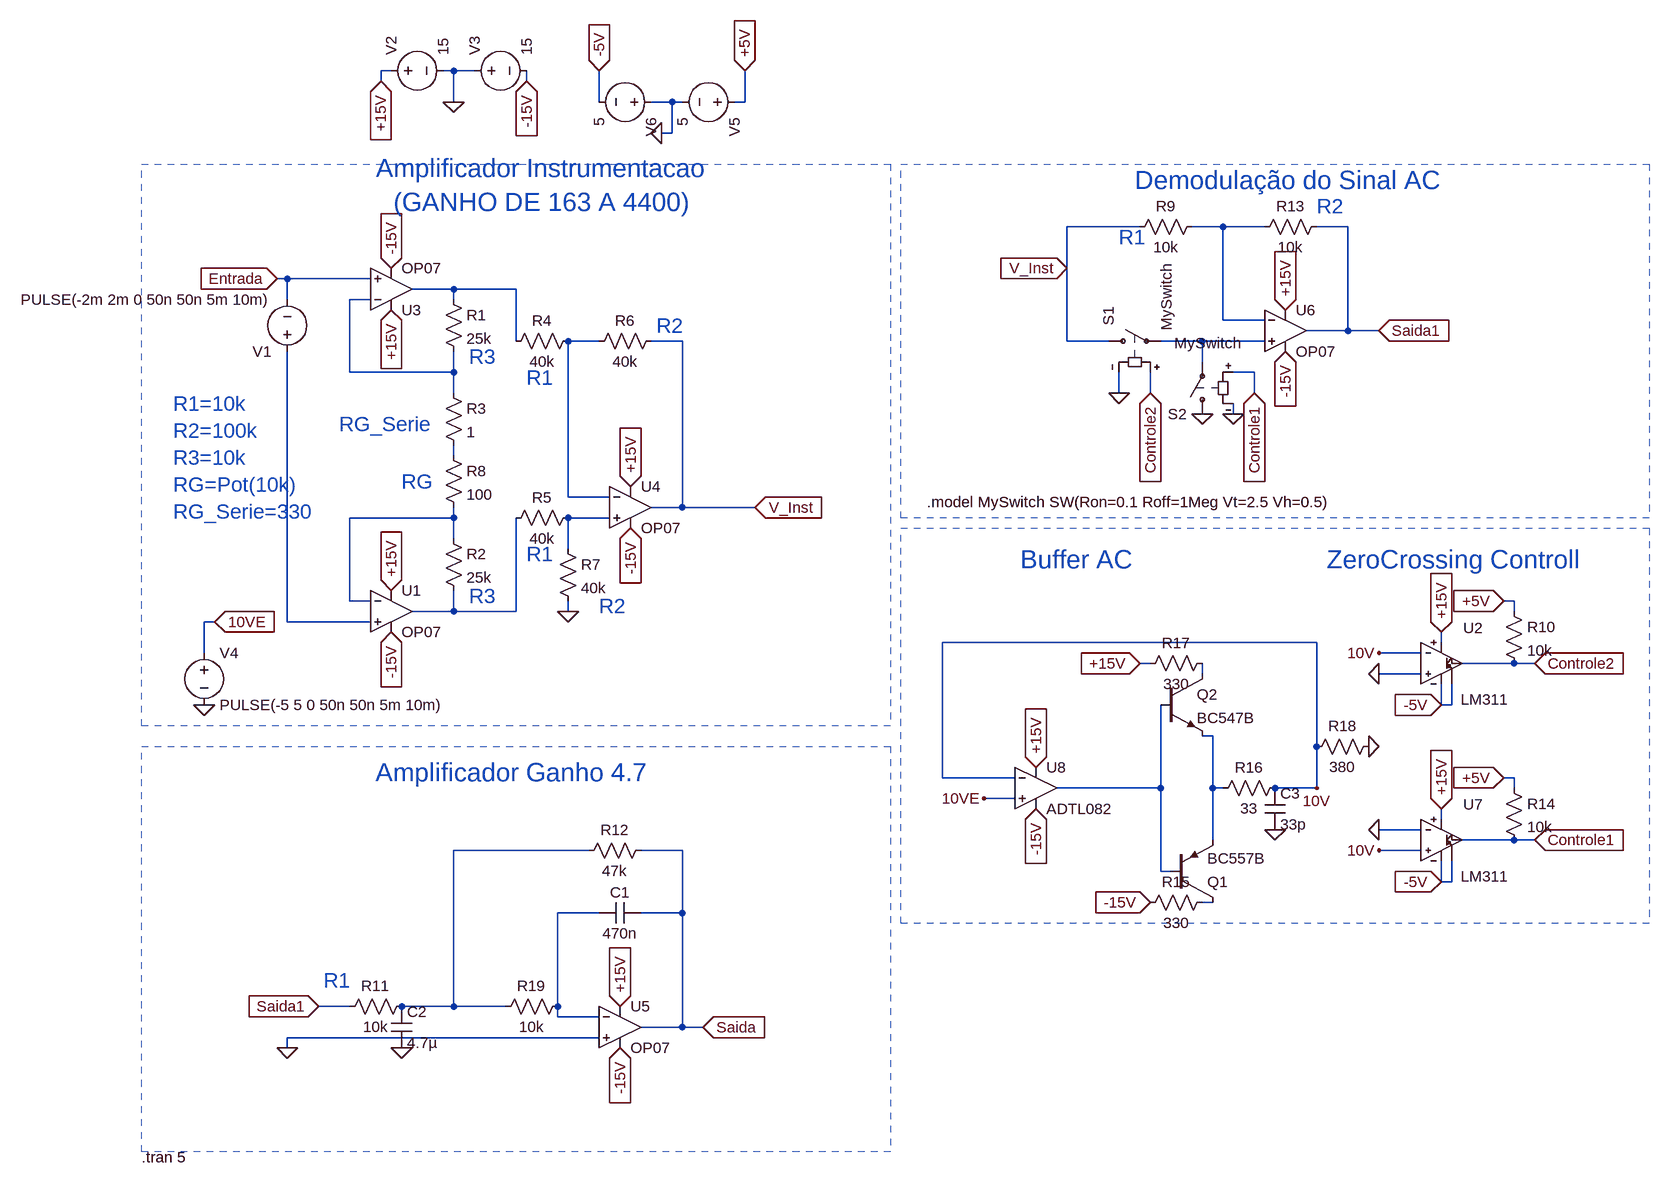
[diagram p0: schematic Projeto1.asc]
Projeto1.asc, the LTspice schematic file:
Version 4.1
SHEET 1 2324 2404
WIRE 384 -496 368 -496
WIRE 480 -496 464 -496
WIRE 512 -496 480 -496
WIRE 368 -480 368 -496
WIRE 592 -480 592 -496
WIRE 480 -448 480 -496
WIRE 704 -448 704 -496
WIRE 816 -448 784 -448
WIRE 832 -448 816 -448
WIRE 928 -448 928 -496
WIRE 928 -448 912 -448
WIRE 816 -400 816 -448
WIRE 816 -400 800 -400
WIRE 1536 -256 1424 -256
WIRE 1664 -256 1616 -256
WIRE 1728 -256 1664 -256
WIRE 1856 -256 1808 -256
WIRE 1424 -192 1424 -256
WIRE 224 -176 208 -176
WIRE 352 -176 224 -176
WIRE 480 -160 416 -160
WIRE 576 -160 480 -160
WIRE 224 -144 224 -176
WIRE 352 -144 320 -144
WIRE 480 -144 480 -160
WIRE 1664 -112 1664 -256
WIRE 1728 -112 1664 -112
WIRE 1856 -96 1856 -256
WIRE 1856 -96 1792 -96
WIRE 1904 -96 1856 -96
WIRE 576 -80 576 -160
WIRE 704 -80 656 -80
WIRE 832 -80 784 -80
WIRE 1424 -80 1424 -192
WIRE 1488 -80 1424 -80
WIRE 1632 -80 1568 -80
WIRE 1728 -80 1632 -80
WIRE 1632 -48 1632 -80
WIRE 320 -32 320 -144
WIRE 480 -32 480 -64
WIRE 480 -32 320 -32
WIRE 1712 -32 1680 -32
WIRE 480 0 480 -32
WIRE 1504 0 1504 -32
WIRE 1552 0 1552 -32
WIRE 1712 0 1712 -32
WIRE 1680 32 1680 16
WIRE 480 96 480 80
WIRE 656 160 656 -80
WIRE 720 160 656 160
WIRE 832 176 832 -80
WIRE 832 176 784 176
WIRE 944 176 832 176
WIRE 480 192 480 176
WIRE 480 192 320 192
WIRE 720 192 656 192
WIRE 480 224 480 192
WIRE 656 240 656 192
WIRE 320 320 320 192
WIRE 352 320 320 320
WIRE 2112 320 2096 320
WIRE 480 336 480 304
WIRE 480 336 416 336
WIRE 576 336 576 192
WIRE 576 336 480 336
WIRE 656 336 656 320
WIRE 2112 336 2112 320
WIRE 112 352 96 352
WIRE 224 352 224 -64
WIRE 352 352 224 352
WIRE 1808 384 1232 384
WIRE 2000 384 2000 368
WIRE 96 400 96 352
WIRE 1968 400 1904 400
WIRE 1552 416 1536 416
WIRE 2112 416 2032 416
WIRE 2144 416 2112 416
WIRE 1632 432 1632 416
WIRE 1968 432 1904 432
WIRE 2000 480 2000 448
WIRE 2016 480 2016 448
WIRE 2016 480 2000 480
WIRE 1648 528 1632 528
WIRE 1808 544 1808 384
WIRE 1232 592 1232 384
WIRE 1344 592 1232 592
WIRE 2112 592 2096 592
WIRE 1568 608 1568 480
WIRE 1568 608 1408 608
WIRE 1648 608 1648 528
WIRE 1664 608 1648 608
WIRE 1808 608 1808 544
WIRE 1808 608 1744 608
WIRE 2112 608 2112 592
WIRE 1344 624 1296 624
WIRE 2000 656 2000 640
WIRE 1968 672 1904 672
WIRE 1648 688 1648 608
WIRE 2112 688 2032 688
WIRE 2144 688 2112 688
WIRE 688 704 480 704
WIRE 832 704 768 704
WIRE 1968 704 1904 704
WIRE 1568 736 1568 608
WIRE 1584 736 1568 736
WIRE 2000 752 2000 720
WIRE 2016 752 2016 720
WIRE 2016 752 2000 752
WIRE 1648 784 1632 784
WIRE 704 800 640 800
WIRE 832 800 832 704
WIRE 832 800 768 800
WIRE 320 944 272 944
WIRE 480 944 480 704
WIRE 480 944 400 944
WIRE 560 944 480 944
WIRE 640 944 640 800
WIRE 640 960 640 944
WIRE 704 960 640 960
WIRE 832 976 832 800
WIRE 832 976 768 976
WIRE 864 976 832 976
WIRE 704 992 224 992
WIRE 224 1008 224 992
FLAG 480 -448 0
FLAG 592 -480 -15V
IOPIN 592 -480 In
FLAG 368 -480 +15V
IOPIN 368 -480 In
FLAG 384 368 -15V
IOPIN 384 368 In
FLAG 384 304 +15V
IOPIN 384 304 In
FLAG 384 -192 -15V
IOPIN 384 -192 In
FLAG 384 -128 +15V
IOPIN 384 -128 In
FLAG 752 208 -15V
IOPIN 752 208 In
FLAG 752 144 +15V
IOPIN 752 144 In
FLAG 656 336 0
FLAG 944 176 V_Inst
IOPIN 944 176 In
FLAG 736 1008 -15V
IOPIN 736 1008 In
FLAG 736 944 +15V
IOPIN 736 944 In
FLAG 864 976 Saida
IOPIN 864 976 In
FLAG 208 -176 Entrada
IOPIN 208 -176 In
FLAG 224 1008 0
FLAG 1760 -64 -15V
IOPIN 1760 -64 In
FLAG 1760 -128 +15V
IOPIN 1760 -128 In
FLAG 1504 0 0
FLAG 1424 -192 V_Inst
IOPIN 1424 -192 In
FLAG 1632 32 0
FLAG 1680 32 0
FLAG 2144 688 Controle1
IOPIN 2144 688 In
FLAG 1904 704 10V
FLAG 1904 672 0
FLAG 2000 752 -5V
IOPIN 2000 752 In
FLAG 2000 640 +15V
IOPIN 2000 640 In
FLAG 2144 416 Controle2
IOPIN 2144 416 In
FLAG 1904 400 10V
FLAG 1904 432 0
FLAG 1552 0 Controle2
IOPIN 1552 0 In
FLAG 96 480 0
FLAG 112 352 10VE
IOPIN 112 352 In
FLAG 800 -400 0
FLAG 704 -496 -5V
IOPIN 704 -496 In
FLAG 928 -496 +5V
IOPIN 928 -496 In
FLAG 1712 0 Controle1
IOPIN 1712 0 In
FLAG 1904 -96 Saida1
IOPIN 1904 -96 In
FLAG 272 944 Saida1
IOPIN 272 944 In
FLAG 1296 624 10VE
FLAG 1552 784 -15V
IOPIN 1552 784 In
FLAG 1376 576 +15V
IOPIN 1376 576 In
FLAG 1376 640 -15V
IOPIN 1376 640 In
FLAG 1808 608 10V
FLAG 1536 416 +15V
IOPIN 1536 416 In
FLAG 1744 672 0
FLAG 1888 544 0
FLAG 2000 480 -5V
IOPIN 2000 480 In
FLAG 2096 320 +5V
IOPIN 2096 320 In
FLAG 2096 592 +5V
IOPIN 2096 592 In
FLAG 400 1008 0
FLAG 2000 368 +15V
IOPIN 2000 368 In
SYMBOL voltage 224 -48 R180
WINDOW 123 0 0 Left 0
WINDOW 39 0 0 Left 0
SYMATTR InstName V1
SYMATTR Value PULSE(-2m 2m 0 50n 50n 5m 10m)
SYMBOL OpAmps\\OP07 384 272 R0
SYMATTR InstName U1
SYMBOL voltage 368 -496 R270
WINDOW 123 0 0 Left 0
WINDOW 39 0 0 Left 0
SYMATTR InstName V2
SYMATTR Value 15
SYMBOL voltage 496 -496 R270
WINDOW 123 0 0 Left 0
WINDOW 39 0 0 Left 0
SYMATTR InstName V3
SYMATTR Value 15
SYMBOL OpAmps\\OP07 384 -96 M180
SYMATTR InstName U3
SYMBOL OpAmps\\OP07 752 112 R0
SYMATTR InstName U4
SYMBOL res 464 -160 R0
SYMATTR InstName R1
SYMATTR Value 25k
SYMBOL res 464 -16 R0
SYMATTR InstName R3
SYMATTR Value 1
SYMBOL res 672 -96 R90
WINDOW 0 0 56 VBottom 2
WINDOW 3 32 56 VTop 2
SYMATTR InstName R4
SYMATTR Value 40k
SYMBOL res 464 80 R0
SYMATTR InstName R8
SYMATTR Value 100
SYMBOL res 416 928 R90
WINDOW 0 0 56 VBottom 2
WINDOW 3 32 56 VTop 2
SYMATTR InstName R11
SYMATTR Value 10k
SYMBOL res 784 688 R90
WINDOW 0 0 56 VBottom 2
WINDOW 3 32 56 VTop 2
SYMATTR InstName R12
SYMATTR Value 47k
SYMBOL OpAmps\\OP07 736 912 R0
SYMATTR InstName U5
SYMBOL res 1632 -272 R90
WINDOW 0 0 56 VBottom 2
WINDOW 3 32 56 VTop 2
SYMATTR InstName R9
SYMATTR Value 10k
SYMBOL OpAmps\\OP07 1760 -160 R0
SYMATTR InstName U6
SYMBOL res 1824 -272 R90
WINDOW 0 0 56 VBottom 2
WINDOW 3 32 56 VTop 2
SYMATTR InstName R13
SYMATTR Value 10k
SYMBOL sw 1472 -80 R270
WINDOW 3 16 105 Left 2
SYMATTR Value MySwitch
SYMATTR InstName S1
SYMBOL sw 1632 48 R180
WINDOW 3 -60 125 Left 2
SYMATTR Value MySwitch
SYMATTR InstName S2
SYMBOL voltage 96 384 R0
WINDOW 123 0 0 Left 0
WINDOW 39 0 0 Left 0
SYMATTR InstName V4
SYMATTR Value PULSE(-5 5 0 50n 50n 5m 10m)
SYMBOL voltage 928 -448 R90
WINDOW 123 0 0 Left 0
WINDOW 39 0 0 Left 0
SYMATTR InstName V5
SYMATTR Value 5
SYMBOL voltage 800 -448 R90
WINDOW 123 0 0 Left 0
WINDOW 39 0 0 Left 0
SYMATTR InstName V6
SYMATTR Value 5
SYMBOL cap 768 784 R90
WINDOW 0 0 32 VBottom 2
WINDOW 3 32 32 VTop 2
SYMATTR InstName C1
SYMATTR Value 470n
SYMBOL pnp 1584 784 M180
SYMATTR InstName Q1
SYMATTR Value BC557B
SYMBOL npn 1568 432 R0
SYMATTR InstName Q2
SYMATTR Value BC547B
SYMBOL LM311 1952 416 R0
SYMATTR InstName U2
SYMBOL res 2096 320 R0
SYMATTR InstName R10
SYMATTR Value 10k
SYMBOL LM311 1952 688 R0
SYMATTR InstName U7
SYMBOL res 2096 592 R0
SYMATTR InstName R14
SYMATTR Value 10k
SYMBOL OpAmps\\ADTL082 1376 544 R0
SYMATTR InstName U8
SYMBOL res 1760 592 R90
WINDOW 0 0 56 VBottom 2
WINDOW 3 32 56 VTop 2
SYMATTR InstName R16
SYMATTR Value 33
SYMBOL cap 1728 608 R0
SYMATTR InstName C3
SYMATTR Value 33p
SYMBOL res 1648 768 R90
WINDOW 0 0 56 VBottom 2
WINDOW 3 32 56 VTop 2
SYMATTR InstName R15
SYMATTR Value 330
SYMBOL res 1648 400 R90
WINDOW 0 0 56 VBottom 2
WINDOW 3 32 56 VTop 2
SYMATTR InstName R17
SYMATTR Value 330
SYMBOL res 1904 528 R90
WINDOW 0 0 56 VBottom 2
WINDOW 3 32 56 VTop 2
SYMATTR InstName R18
SYMATTR Value 380
SYMBOL res 464 208 R0
SYMATTR InstName R2
SYMATTR Value 25k
SYMBOL res 672 176 R90
WINDOW 0 0 56 VBottom 2
WINDOW 3 32 56 VTop 2
SYMATTR InstName R5
SYMATTR Value 40k
SYMBOL res 800 -96 R90
WINDOW 0 0 56 VBottom 2
WINDOW 3 32 56 VTop 2
SYMATTR InstName R6
SYMATTR Value 40k
SYMBOL res 640 224 R0
SYMATTR InstName R7
SYMATTR Value 40k
SYMBOL cap 384 944 R0
SYMATTR InstName C2
SYMATTR Value 4.7µ
SYMBOL res 656 928 R90
WINDOW 0 0 56 VBottom 2
WINDOW 3 32 56 VTop 2
SYMATTR InstName R19
SYMATTR Value 10k
TEXT 704 328 Left 3 ;R2
TEXT 592 248 Left 3 ;R1
TEXT 792 -104 Left 3 ;R2
TEXT 592 -24 Left 3 ;R1
TEXT 504 -56 Left 3 ;R3
TEXT 504 312 Left 3 ;R3
TEXT 304 48 Left 3 ;RG_Serie
TEXT 48 16 Left 3 ;R1=10k\nR2=100k\nR3=10k\nRG=Pot(10k)\nRG_Serie=330
TEXT 616 -320 Center 4 ;Amplificador Instrumentacao\n(GANHO DE 163 A 4400)
TEXT 360 584 Left 4 ;Amplificador Ganho 4.7
TEXT 280 904 Left 3 ;R1
TEXT 400 136 Left 3 ;RG
TEXT 0 1176 Left 2 !.tran 5
TEXT 1504 -240 Left 3 ;R1
TEXT 1808 -288 Left 3 ;R2
TEXT 1208 168 Left 2 !.model MySwitch SW(Ron=0.1 Roff=1Meg Vt=2.5 Vh=0.5)
TEXT 1824 256 Left 4 ;ZeroCrossing Controll
TEXT 1352 256 Left 4 ;Buffer AC
TEXT 1528 -328 Left 4 ;Demodulação do Sinal AC
RECTANGLE Normal 1152 512 0 -352 2
RECTANGLE Normal 1152 1168 0 544 2
RECTANGLE Normal 2320 816 1168 208 2
RECTANGLE Normal 2320 192 1168 -352 2

The netlist it stands for:
* Projeto1.asc
V1 N010 Entrada PULSE(-2m 2m 0 50n 50n 5m 10m)
X§U1 N010 N007 +15V -15V N009 LT1001  ; OP07, pins In+ In- V+ V- OUT
V2 +15V 0 15
V3 0 -15V 15
X§U3 Entrada N003 +15V -15V N002 LT1001  ; OP07, pins In+ In- V+ V- OUT
X§U4 N008 N004 +15V -15V V_Inst LT1001  ; OP07, pins In+ In- V+ V- OUT
R1 N002 N003 25k
R3 N003 N006 1
R4 N004 N002 40k
R8 N006 N007 100
R11 N014 Saida1 10k
R12 Saida N014 47k
X§U5 0 N016 +15V -15V Saida LT1001  ; OP07, pins In+ In- V+ V- OUT
R9 N001 V_Inst 10k
X§U6 N005 N001 +15V -15V Saida1 LT1001  ; OP07, pins In+ In- V+ V- OUT
R13 Saida1 N001 10k
S1 V_Inst N005 Controle2 0 MySwitch
S2 0 N005 Controle1 0 MySwitch
V4 10VE 0 PULSE(-5 5 0 50n 50n 5m 10m)
V5 +5V 0 5
V6 0 -5V 5
C1 Saida N016 470n
Q1 N015 N013 N012 0 BC557B
Q2 N011 N013 N012 0 BC547B
X§U2 0 10V +15V -5V Controle2 -5V LM311  ; pins In+ In- V+ V- OUT EmitOut
R10 +5V Controle2 10k
X§U7 10V 0 +15V -5V Controle1 -5V LM311  ; pins In+ In- V+ V- OUT EmitOut
R14 +5V Controle1 10k
X§U8 10VE 10V +15V -15V N013 ADTL082  ; pins In+ In- V+ V- OUT
R16 10V N012 33
C3 10V 0 33p
R15 N015 -15V 330
R17 N011 +15V 330
R18 0 10V 380
R2 N007 N009 25k
R5 N008 N009 40k
R6 V_Inst N004 40k
R7 N008 0 40k
C2 N014 0 4.7µ
R19 N016 N014 10k
.model NPN NPN
.model PNP PNP
.lib standard.bjt
* R2
* R1
* R2
* R1
* R3
* R3
* RG_Serie
* R1=10k
* R2=100k
* R3=10k
* RG=Pot(10k)
* RG_Serie=330
* Amplificador Instrumentacao
* (GANHO DE 163 A 4400)
* Amplificador Ganho 4.7
* R1
* RG
.tran 5
* R1
* R2
.model MySwitch SW(Ron=0.1 Roff=1Meg Vt=2.5 Vh=0.5)
* ZeroCrossing Controll
* Buffer AC
* Demodulação do Sinal AC
.lib LTC.lib
.lib LM311.lib
.lib ADI.lib
.backanno
.end